# Altium project ControladorCarga.PrjPcb
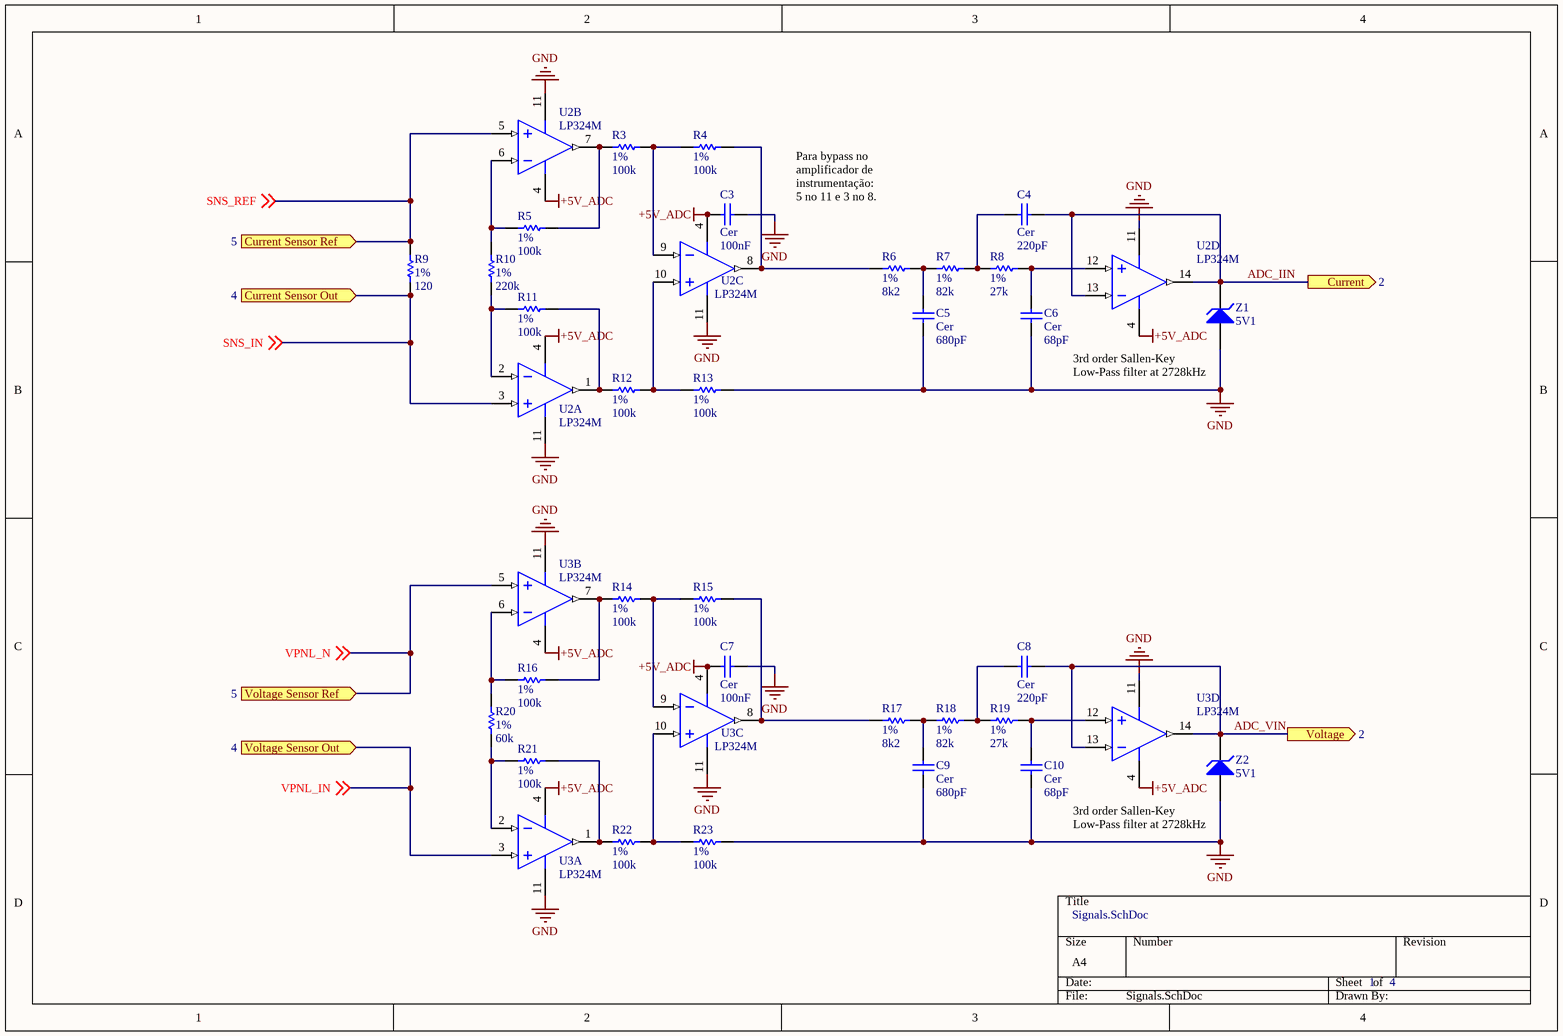
[diagram p0: Signals.SchDoc]
5 sheets, 102 parts. Net scope: flat (ports and power ports of the same name join across sheets).
Board file: PCB4.PcbDoc
Sheets:
  Signals.SchDoc
  uController.SchDoc
  voltageSupplies.SchDoc
  cuk.SchDoc
  protecao.SchDoc

## Sheet Signals.SchDoc: Signals.SchDoc
size A4; DocumentNumber: 2; SheetNumber: 1; SheetTotal: 4

### Parts
C3  Cer  value 100nF  [C1210_M]
C4  Cer  value 220pF  [6-0805_M]
C5  Cer  value 680pF  [6-0805_M]
C6  Cer  value 68pF  [6-0805_M]
C7  Cer  value 100nF  [C1210_M]
C8  Cer  value 220pF  [6-0805_M]
C9  Cer  value 680pF  [6-0805_M]
C10  Cer  value 68pF  [6-0805_M]
R3  1%  value 100k  [6-0805_M]
R4  1%  value 100k  [6-0805_M]
R5  1%  value 100k  [6-0805_M]
R6  1%  value 8k2  [6-0805_M]
R7  1%  value 82k  [6-0805_M]
R8  1%  value 27k  [6-0805_M]
R9  1%  value 120  [6-0805_M]
R10  1%  value 220k  [6-0805_M]
R11  1%  value 100k  [6-0805_M]
R12  1%  value 100k  [6-0805_M]
R13  1%  value 100k  [6-0805_M]
R14  1%  value 100k  [6-0805_M]
R15  1%  value 100k  [6-0805_M]
R16  1%  value 100k  [6-0805_M]
R17  1%  value 8k2  [6-0805_M]
R18  1%  value 82k  [6-0805_M]
R19  1%  value 27k  [6-0805_M]
R20  1%  value 60k  [6-0805_M]
R21  1%  value 100k  [6-0805_M]
R22  1%  value 100k  [6-0805_M]
R23  1%  value 100k  [6-0805_M]
U2  LP324M  [M14A_M]  (parts A,B,C,D of 4)
U3  LP324M  [M14A_M]  (parts A,B,C,D of 4)
Z1  5V1  [C1210_M]
Z2  5V1  [C1210_M]

### Ports
Current (out, see 2), Current Sensor Out (in, see 4), Current Sensor Ref (in, see 5), Voltage (out, see 2), Voltage Sensor Out (in, see 4), Voltage Sensor Ref (in, see 5)

### Nets
+5V_ADC: C3.2 C7.2 U2.4(V+) U3.4(V+)
GND: C3.1 C5.1 C6.1 C7.1 C9.1 C10.1 R13.1 R23.1 U2.11(GND) U3.11(GND) Z1.1(A) Z2.1(A)
ADC_IIN: C4.2 U2.13(IN4-) U2.14(OUT4) Z1.2(K) ; port Current
ADC_VIN: C8.2 U3.13(IN4-) U3.14(OUT4) Z2.2(K) ; port Voltage
SNS_IN: R9.1 U2.3(IN1+) ; off-sheet SNS_IN, port Current Sensor Out
SNS_REF: R9.2 U2.5(IN2+) ; off-sheet SNS_REF, port Current Sensor Ref
VPNL_IN: U3.3(IN1+) ; off-sheet VPNL_IN, port Voltage Sensor Out
VPNL_N: U3.5(IN2+) ; off-sheet VPNL_N, port Voltage Sensor Ref
NetC4_1: C4.1 R7.1 R8.2
NetC5_2: C5.2 R6.1 R7.2
NetC6_2: C6.2 R8.1 U2.12(IN4+)
NetC8_1: C8.1 R18.1 R19.2
NetC9_2: C9.2 R17.1 R18.2
NetC10_2: C10.2 R19.1 U3.12(IN4+)
NetR3_1: R3.1 R4.2 U2.9(IN3-)
NetR3_2: R3.2 R5.2 U2.7(OUT2)
NetR4_1: R4.1 R6.2 U2.8(OUT3)
NetR5_1: R5.1 R10.2 U2.6(IN2-)
NetR10_1: R10.1 R11.2 U2.2(IN1-)
NetR11_1: R11.1 R12.2 U2.1(OUT1)
NetR12_1: R12.1 R13.2 U2.10(IN3+)
NetR14_1: R14.1 R15.2 U3.9(IN3-)
NetR14_2: R14.2 R16.2 U3.7(OUT2)
NetR15_1: R15.1 R17.2 U3.8(OUT3)
NetR16_1: R16.1 R20.2 U3.6(IN2-)
NetR20_1: R20.1 R21.2 U3.2(IN1-)
NetR21_1: R21.1 R22.2 U3.1(OUT1)
NetR22_1: R22.1 R23.2 U3.10(IN3+)

### Notes on the sheet
- Para bypass no amplificador de instrumentação:
  5 no 11 e 3 no 8.
- 3rd order Sallen-Key Low-Pass filter at 2728kHz

### Library data of the parts
C3-C10 = Cap: Capacitor; Published: 8-Jun-2000; LatestRevisionDate: 17-Jul-2002; LatestRevisionNote: Re-released for DXP Platform.; PackageReference: RAD-0.3; Publisher: Altium Limited; PackageDescription: Radial Cap, Thru-Hole; 2 Leads; 0.3 in Pin Spacing
R3-R23 = Res1: Resistor; Published: 8-Jun-2000; LatestRevisionDate: 17-Jul-2002; LatestRevisionNote: Re-released for DXP Platform.; PackageReference: AXIAL-0.3; Publisher: Altium Limited; PackageDescription: Axial Device, Thru-Hole; 2 Leads; 0.3 in Pin Spacing
U2 U3 = LP324M: Micropower Quad Operational Amplifier; Manufacturer: National Semiconductor; CompType: Amplifiers; PackageTopMarking: NSUZXYTT*LP324M; PowerWise: N; Published: 4-Dec-2008; DatasheetVersion: Jul-2001; PackageVersion: revJ, Jan-1996; PackageReference: M14A; Publisher: Altium Limited; PackageDescription: Molded Package S.O., .150in Wide, 14 Lead; PartNumber: LP324M; RoHS: O; PinCount: 14; DigiKeyPartNumber: LP324MXCT-ND; Code_JEDEC: MS-012AB; Code_IPC: SOIC127P600-14; ComponentLink1Description: LP324 Datasheet; ComponentLink1URL: http://www.national.com/ds/LP/LP324.pdf; ComponentLink2Description: LP324 Web Page; ComponentLink2URL: http://www.national.com/pf/LP/LP324.html; ComponentLink3Description: M14A Package Page; ComponentLink3URL: http://www.national.com/packaging/folders/m14a.html
Z1 Z2 = D Zener: Zener Diode; Published: 8-Jun-2000; LatestRevisionDate: 17-Jul-2002; LatestRevisionNote: Re-released for DXP Platform.; PackageReference: DIODE-0.7; Publisher: Altium Limited; PackageDescription: Diode, Thru-Hole; 2 Leads; 0.7 in Pin Spacing

## Sheet uController.SchDoc: uController.SchDoc
size A4; DocumentNumber: 3; SheetNumber: 2; SheetTotal: 4; PageSetup: Record=PageOptions|CenterHorizontal=True|CenterVertical=True|PrintScale=0.73|XCorrection=1.00|YCorrection=1.00|PrintKind=1|BorderSize=5000000|LeftOffset=0|BottomOffset=0|Orientation=2|PaperLength=1000|PaperWidth=1000|Scale=100|PaperSource=257|PrintQuality=1200|MediaType=1|DitherType=10|PaperKind=A4|PrintScaleMode=1
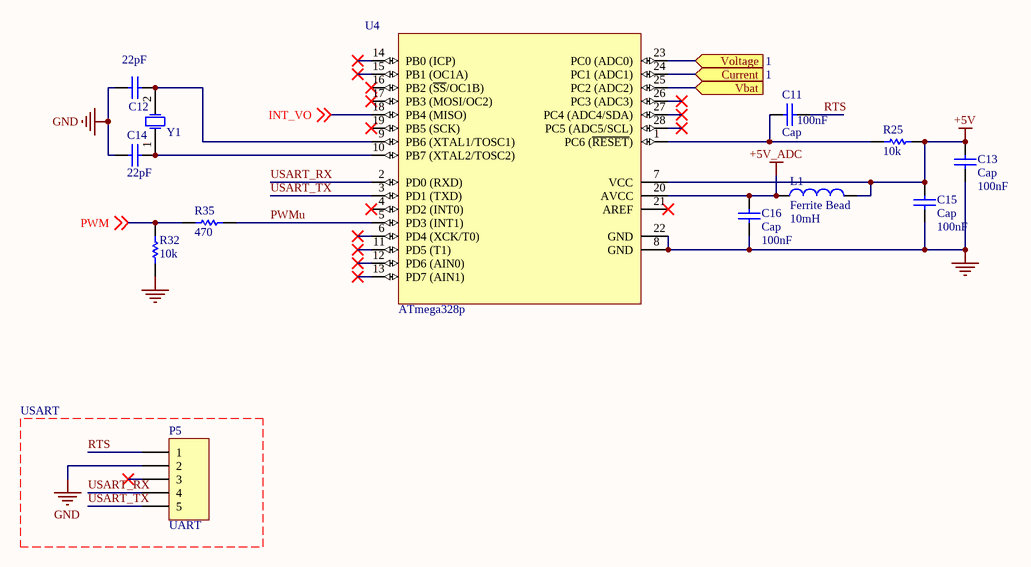
[diagram p1: uController.SchDoc]

### Parts
C11  Cap  value 100nF  [6-0805_M]
C12  22pF  [C0805]
C13  Cap  value 100nF  [C1210_M]
C14  22pF  [C0805]
C15  Cap  value 100nF  [6-0805_M]
C16  Cap  value 100nF  [6-0805_M]
L1  Ferrite Bead  value 10mH  [6-0805_M]
P5  UART  [HDR1X5]
R25  value 10k  [6-0805_M]  (hidden comment: Res1)
R32  value 10k  [6-0805_M]  (hidden comment: Res1)
R35  470  [6-0805_M]
U4  ATmega328p  [28P3]
Y1  (no value)  [HC-49U]

### Ports
Current (in, see 1), Vbat (in), Voltage (in, see 1)

### Nets
+5V: C13.1 C15.1 L1.2 R25.2 U4.7(VCC)
+5V_ADC: C16.1 L1.1 U4.20(AVCC)
GND: C12.1 C13.2 C14.1 C15.2 C16.2 P5.2 R32.1 U4.8(GND) U4.22(GND)
ADC_IIN: U4.24(PC1_(ADC1)) ; port Current
ADC_Vbat: U4.25(PC2_(ADC2)) ; port Vbat
ADC_VIN: U4.23(PC0_(ADC0)) ; port Voltage
INT_VO: U4.18(PB4_(MISO)) ; off-sheet INT_VO
PWM: R32.2 R35.1 ; off-sheet PWM
PWMu: R35.2 U4.5(PD3_(INT1))
RTS: C11.2 P5.1
USART_RX: P5.4 U4.2(PD0_(RXD))
USART_TX: P5.5 U4.3(PD1_(TXD))
NetC11_1: C11.1 R25.1 U4.1(PC6_(~{RESET}))
NetC12_2: C12.2 U4.9(PB6_(XTAL1/TOSC1)) Y1.2(OSC2)
NetC14_2: C14.2 U4.10(PB7_(XTAL2/TOSC2)) Y1.1(OSC1)

Not connected (* = marked no-connect by the designer): P5 3*; U4 4(PD2_(INT0))* 6(PD4_(XCK/T0))* 11(PD5_(T1))* 12(PD6_(AIN0))* 13(PD7_(AIN1))* 14(PB0_(ICP))* 15(PB1_(OC1A))* 16(PB2_(~{SS}/OC1B))* 17(PB3_(MOSI/OC2))* 19(PB5_(SCK))* 21(AREF)* 26(PC3_(ADC3))* 27(PC4_(ADC4/SDA))* 28(PC5_(ADC5/SCL))*

### Notes on the sheet
- USART

### Library data of the parts
C11 C13 C15 C16 = Cap: Capacitor; Published: 8-Jun-2000; LatestRevisionDate: 17-Jul-2002; LatestRevisionNote: Re-released for DXP Platform.; PackageReference: RAD-0.3; Publisher: Altium Limited; PackageDescription: Radial Cap, Thru-Hole; 2 Leads; 0.3 in Pin Spacing
C12 C14 = Cap Semi: Capacitor (Semiconductor SIM Model); Published: 8-Jun-2000; LatestRevisionDate: 29-May-2009; LatestRevisionNote: IPC-7351 Footprint Added.; PackageReference: C1206; Publisher: Altium Limited; PackageDescription: Chip Capacitor; Value: 22pF
L1 = Inductor: Code_IEC: 1005; Published: 8-Jun-2000; LatestRevisionDate: 29-May-2009; LatestRevisionNote: IPC-7351 Footprint Added.; PackageReference: 0402-A; Publisher: Altium Limited; PackageDescription: Chip Inductor; Code_JEITA: 0402
P5 = Header 5: Header, 5-Pin; LatestRevisionDate: 17-Jul-2002; LatestRevisionNote: Re-released for DXP Platform.; Publisher: Altium Limited
R25 R32 R35 = Res1: Resistor; Published: 8-Jun-2000; LatestRevisionDate: 17-Jul-2002; LatestRevisionNote: Re-released for DXP Platform.; PackageReference: AXIAL-0.3; Publisher: Altium Limited; PackageDescription: Axial Device, Thru-Hole; 2 Leads; 0.3 in Pin Spacing
  R35: Value: 470
U4 = ATmega8-16PI: 8-Bit AVR Microcontroller with 8K Bytes of In-System Programmable Flash Memory; Published: 17-Sep-2003; LatestRevisionDate: 04-Mar-2005; LatestRevisionNote: Stylized 3D Model Added.; DatasheetVersion: 2486H-AVR-09/02; PackageVersion: revB, Sep-2001; PackageReference: 28P3; Publisher: Altium Limited; PackageDescription: DIP; 28 Leads; Row Spacing 7.62 mm; Pitch 2.54 mm; ComponentLink1Description: Manufacturer Link; ComponentLink1URL: http://www.atmel.com; ComponentLink2Description: Datasheet; ComponentLink2URL: http://www.atmel.com/dyn/resources/prod_documents/doc2486.pdf
Y1 = Crystal: Crystal Oscillator

## Sheet voltageSupplies.SchDoc: voltageSupplies.SchDoc
size A; DocumentNumber: 4; SheetNumber: 3; SheetTotal: 4
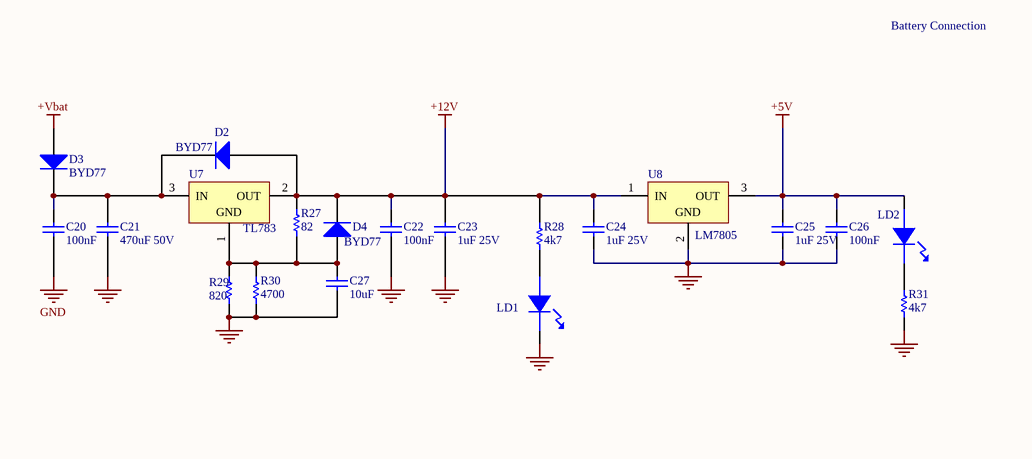
[diagram p2: voltageSupplies.SchDoc]

### Parts
C20  value 100nF  [C1210_M]  (hidden comment: Cap)
C21  value 470uF 50V  [CapEltr-Rad4.1-Dpp3.0]  (hidden comment: Cap)
C22  value 100nF  [C1210_M]  (hidden comment: Cap)
C23  value 1uF 25V  [CapEltr-Rad4.1-Dpp3.0]  (hidden comment: Cap)
C24  value 1uF 25V  [CapEltr-Rad4.1-Dpp3.0]  (hidden comment: Cap)
C25  value 1uF 25V  [CapEltr-Rad4.1-Dpp3.0]  (hidden comment: Cap)
C26  value 100nF  [C1210_M]  (hidden comment: Cap)
C27  value 10uF  [C1210_M]  (hidden comment: Cap)
D2  BYD77  [SOD87]
D3  value BYD77  [SOD87]  (hidden comment: Diode 1N4002)
D4  value BYD77  [SOD87]  (hidden comment: 1N4002)
LD1  RED  [6-0805_M]  (value not drawn)
LD2  RED  [6-0805_M]  (value not drawn)
R27  value 82  [6-0805_M]  (hidden comment: Res1)
R28  value 4k7  [6-0805_M]  (hidden comment: Res1)
R29  value 820  [6-0805_M]  (hidden comment: Res1)
R30  value 4700  [6-0805_M]  (hidden comment: Res1)
R31  value 4k7  [6-0805_M]  (hidden comment: Res1)
U7  TL783  [TO-220AB]
U8  LM7805  [TO-220AB]

### Nets
+5V: C25.2 C26.2 LD2.1 U8.3(OUT)
+12V: C22.2 C23.2 C24.2 D2.1(A) D4.2(K) R27.1 R28.2 U7.2(OUT) U8.1(IN)
+Vbat: D3.1(A)
GND: C20.1 C21.1 C22.1 C23.1 C24.1 C25.1 C26.1 C27.1 LD1.2 R29.1 R30.1 R31.1 U8.2(GND)
NetC20_2: C20.2 C21.2 D2.2(K) D3.2(K) U7.3(IN)
NetC27_2: C27.2 D4.1(A) R27.2 R29.2 R30.2 U7.1(ADJ)
NetLD1_1: LD1.1 R28.1
NetLD2_2: LD2.2 R31.2

### Notes on the sheet
- Battery Connection
- Pinagem compativel com LM317, modificando os resistores para:
  R3=240, R7=2k2, R6=33k
  tl783 -> (R102 // R103) = ((Vo/Vref) – 1) / R100
- (in symbol L7805ACV) GND

### Library data of the parts
C20-C27 = Cap: Capacitor; Published: 8-Jun-2000; LatestRevisionDate: 17-Jul-2002; LatestRevisionNote: Re-released for DXP Platform.; PackageReference: RAD-0.3; Publisher: Altium Limited; PackageDescription: Radial Cap, Thru-Hole; 2 Leads; 0.3 in Pin Spacing
D2-D4 = Diode 1N4002: 1 Amp General Purpose Rectifier; pin to pad: 1>A 2>K; Published: 8-Jun-2000; LatestRevisionDate: 17-Jul-2002; LatestRevisionNote: Re-released for DXP Platform.; DatasheetVersion: 1998; PackageVersion: Aug-1999; PackageReference: DO-41; Publisher: Altium Limited; PackageDescription: Diode, Axial; Body 5.2 x 2.7 mm (LxDia. max), Lead Dia. 0.86 mm (max); Code_JEDEC: DO-204-AL; ComponentLink1Description: Manufacturer Link; ComponentLink1URL: http://www.fairchildsemi.com/; ComponentLink2Description: Datasheet; ComponentLink2URL: http://www.fairchildsemi.com/ds/1N%2F1N4001.pdf
  D2: value: BYD77
LD1 LD2 = LED: Diodo Emissor de Luz; value: Led 0805 Vermelho
R27-R31 = Res1: Resistor; Published: 8-Jun-2000; LatestRevisionDate: 17-Jul-2002; LatestRevisionNote: Re-released for DXP Platform.; PackageReference: AXIAL-0.3; Publisher: Altium Limited; PackageDescription: Axial Device, Thru-Hole; 2 Leads; 0.3 in Pin Spacing
U7 = L7805ACV: Precision 1A Regulator; Note: Tab is connected to pin 3 (GND).; value: LT783; Published: 24-Aug-2001; LatestRevisionDate: 17-Jul-2002; LatestRevisionNote: Re-released for DXP Platform.; DatasheetVersion: Nov-1999; PackageVersion: Jun-1998; PackageReference: TO220ABN; Publisher: Altium Limited; PackageDescription: TO, Thru-Hole, Vertical, Heatsink Mounted; 3 In-Line Leads; Pitch 2.54 mm; Pin sequence 1, 3, 2; ComponentLink1Description: Manufacturer Link; ComponentLink1URL: http://www.st.com/; ComponentLink2Description: Datasheet; ComponentLink2URL: http://www.st.com/stonline/products/literature/ds/2144/l7805ab.pdf
U8 = µA7805CKC: Positive-Voltage Regulator; Note: Pin 2 is electrically connected to TAB.; Published: 15-Apr-2002; DatasheetVersion: Jul-1999; PackageVersion: Sep-1995; PackageReference: KC03; Publisher: Altium Limited; PackageDescription: TO, Thru-Hole, Vertical, Heatsink Mounted; 3 In-Line Leads; Pitch 2.54 mm; ComponentLink1Description: Manufacturer Link; ComponentLink1URL: http://www.ti.com/; ComponentLink2Description: Datasheet; ComponentLink2URL: http://www-s.ti.com/sc/ds/ua7805.pdf

## Sheet cuk.SchDoc: cuh.SchDoc
size A4; DocumentNumber: 5; SheetNumber: 4; SheetTotal: 4
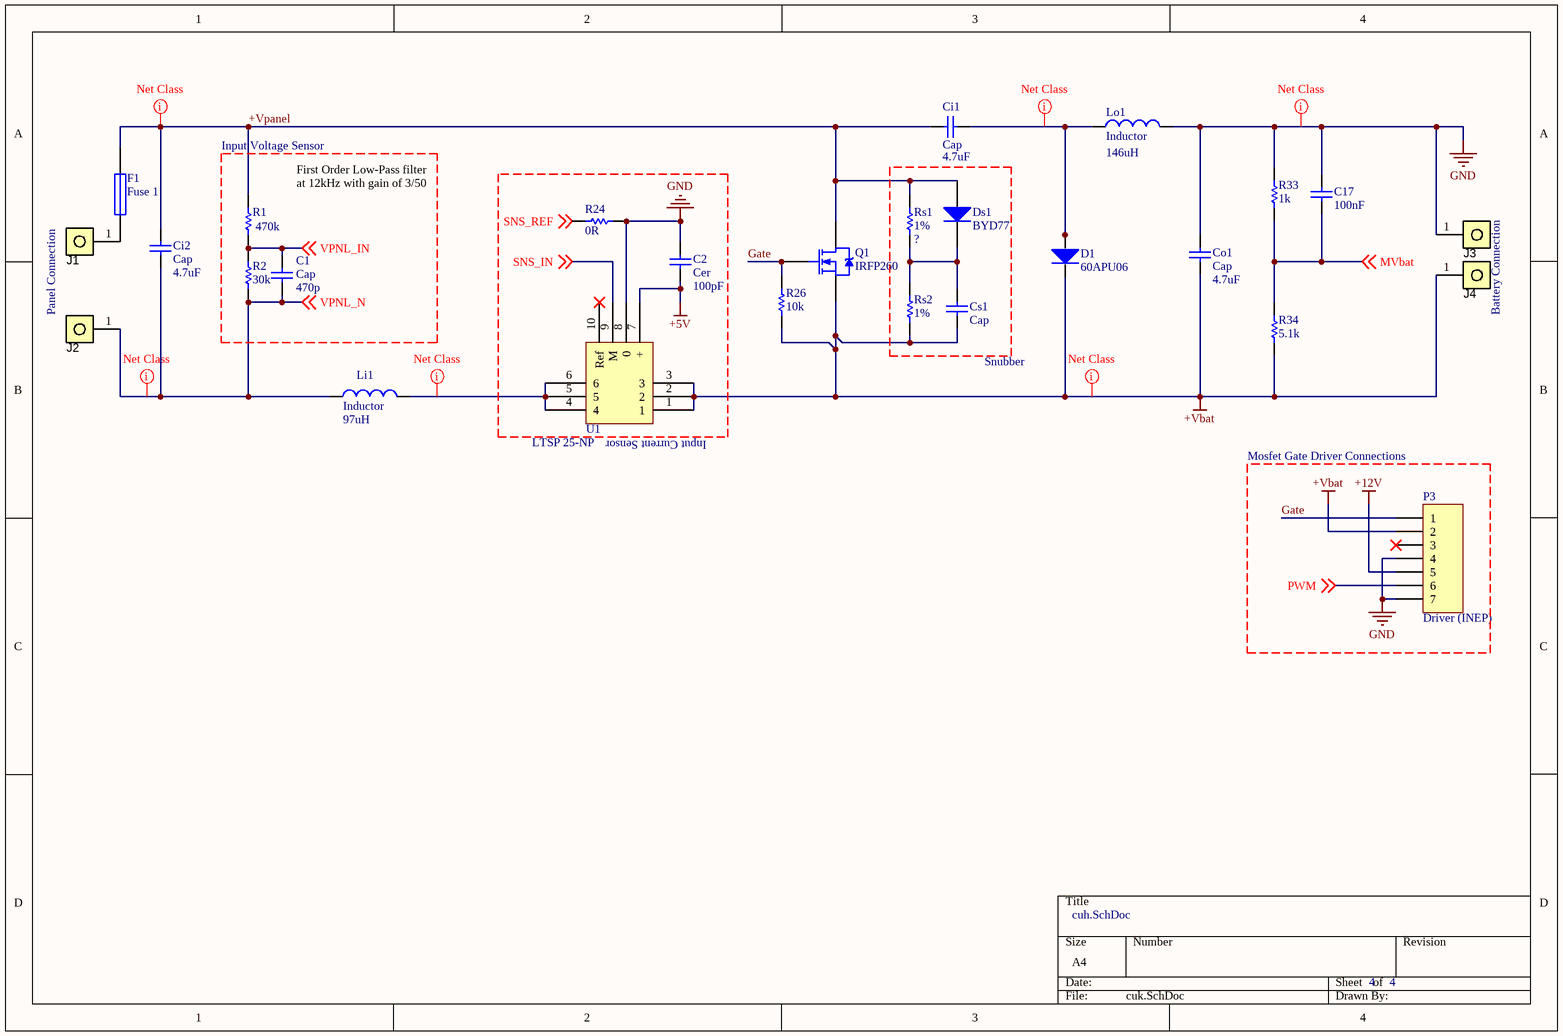
[diagram p3: cuk.SchDoc]

### Parts
C1  Cap  value 470p  [6-0805_N]
C2  Cer  value 100pF  [C1210_M]
C17  100nF  [6-0805_M]
Ci1  Cap  value 4.7uF  [CAP4U7 EPCOS]
Ci2  Cap  value 4.7uF  [CAP4U7 EPCOS]
Co1  Cap  value 4.7uF  [CAP4U7 EPCOS]
Cs1  Cap  [100nF]
D1  60APU06  [to-247ac_horizontal]
Ds1  BYD77  [SOD87]
F1  Fuse 1  [FUSE HOLDER 5X20]
J1  (no value)  [Parafuso]
J2  (no value)  [Parafuso]
J3  (no value)  [Parafuso]
J4  (no value)  [Parafuso]
Li1  Inductor  value 97uH  [NEE-42-20-deitado]
Lo1  Inductor  value 146uH  [NEE-42-20-deitado]
P3  Driver (INEP)  [Driver INEP]
Q1  IRFP260  [to-247ac_horizontal]
R1  value 470k  [6-0805_N]  (hidden comment: Res1)
R2  value 30k  [6-0805_N]  (hidden comment: Res1)
R24  value 0R  [6-0805_N]  (hidden comment: Res1)
R26  value 10k  [6-0805_N]  (hidden comment: Res1)
R33  1k  [6-0805_M]
R34  5.1k  [6-0805_M]
Rs1  1%  [AXIAL-0.3]
Rs2  1%  [AXIAL-0.3]
U1  LTSP 25-NP  [LTSP 25-NP]

### Nets
+5V: C2.1 U1.7(+)
+12V: P3.5
+Vbat: Co1.1 Cs1.1 D1.2(K) J4.1 P3.2 Q1.3(S) R26.2 R34.1 Rs2.2 U1.1 U1.2 U1.3
GND: C2.2 C17.2 Co1.2 J3.1 Lo1.2 P3.4 P3.7 R24.2 R33.2 U1.8(0)
+Vpanel: Ci1.1 Ci2.2 Ds1.1(A) F1.2 Q1.2(D) R1.1 Rs1.2
Gate: P3.1 Q1.1(G) R26.1
MVbat: C17.1 R33.1 R34.2 ; off-sheet MVbat
PWM: P3.6 ; off-sheet PWM
SNS_IN: U1.9(M) ; off-sheet SNS_IN
SNS_REF: R24.1 ; off-sheet SNS_REF
VPNL_IN: C1.1 R1.2 R2.1 ; off-sheet VPNL_IN
VPNL_N: C1.2 Ci2.1 J2.1 Li1.1 R2.2 ; off-sheet VPNL_N
NetCi1_2: Ci1.2 D1.1(A) D1.3(A) Lo1.1
NetCs1_2: Cs1.2 Ds1.2(K) Rs1.1 Rs2.1
NetF1_1: F1.1 J1.1
NetLi1_2: Li1.2 U1.4 U1.5 U1.6

Not connected (* = marked no-connect by the designer): P3 3*; U1 10(Ref)*

### Layout directives
net class PanelBetweenBatteryConnection: +Vbat, +Vpanel, GND, NetCi1_2, NetLi1_2, VPNL_N

### Notes on the sheet
- Input Voltage Sensor
- First Order Low-Pass filter at 12kHz with gain of 3/50
- Panel Connection
- Battery Connection
- (near Cs1) Snubber
- (near U1) Input Current Sensor
- Mosfet Gate Driver Connections

### Library data of the parts
C1 C2 Ci1 Ci2 Co1 Cs1 = Cap: Capacitor; Published: 8-Jun-2000; LatestRevisionDate: 17-Jul-2002; LatestRevisionNote: Re-released for DXP Platform.; PackageReference: RAD-0.3; Publisher: Altium Limited; PackageDescription: Radial Cap, Thru-Hole; 2 Leads; 0.3 in Pin Spacing
  Cs1: Value: ?
C17 = Cap_3: Capacitor; Published: 8-Jun-2000; LatestRevisionDate: 17-Jul-2002; LatestRevisionNote: Re-released for DXP Platform.; PackageReference: RAD-0.3; Publisher: Altium Limited; PackageDescription: Radial Cap, Thru-Hole; 2 Leads; 0.3 in Pin Spacing; Value: 100nF
Ds1 = Diode 1N4002: 1 Amp General Purpose Rectifier; pin to pad: 1>A 2>K; Published: 8-Jun-2000; LatestRevisionDate: 17-Jul-2002; LatestRevisionNote: Re-released for DXP Platform.; DatasheetVersion: 1998; PackageVersion: Aug-1999; PackageReference: DO-41; Publisher: Altium Limited; PackageDescription: Diode, Axial; Body 5.2 x 2.7 mm (LxDia. max), Lead Dia. 0.86 mm (max); Code_JEDEC: DO-204-AL; ComponentLink1Description: Manufacturer Link; ComponentLink1URL: http://www.fairchildsemi.com/; ComponentLink2Description: Datasheet; ComponentLink2URL: http://www.fairchildsemi.com/ds/1N%2F1N4001.pdf; value: BYD77
F1 = Fuse 1: Fuse; Published: 8-Jun-2000; LatestRevisionDate: 17-Jul-2002; LatestRevisionNote: Re-released for DXP Platform.; PackageReference: PIN-W2/E2.8; Publisher: Altium Limited; PackageDescription: Thru-Hole; 2 Leads
J1-J4 = PIN_BIG: Description 1: Header 1x1; Código: PIN_BIG; Footprint: CON_1_big; PackageReference: CON_1_big
Li1 = Inductor: Code_IEC: 1005; Published: 8-Jun-2000; LatestRevisionDate: 29-May-2009; LatestRevisionNote: IPC-7351 Footprint Added.; PackageReference: 0402-A; Publisher: Altium Limited; PackageDescription: Chip Inductor; Code_JEITA: 0402
Lo1 = Inductor: pin to pad: 1>2 2>1; Code_IEC: 1005; Published: 8-Jun-2000; LatestRevisionDate: 29-May-2009; LatestRevisionNote: IPC-7351 Footprint Added.; PackageReference: 0402-A; Publisher: Altium Limited; PackageDescription: Chip Inductor; Code_JEITA: 0402
P3 = Header 7: Header, 7-Pin; LatestRevisionDate: 17-Jul-2002; LatestRevisionNote: Re-released for DXP Platform.; Publisher: Altium Limited
Q1 = IRFP260: HEXFET Power MOSFET; Note: Pin 2 is electrically connected to the Heatsink (4).; Published: 8-Jun-2000; LatestRevisionDate: 17-Jul-2002; LatestRevisionNote: Re-released for DXP Platform.; DatasheetVersion: PD-9.755; PackageVersion: Aug-1997; PackageReference: TO-247AC; Publisher: Altium Limited; PackageDescription: SIP with Mounting Hole; 3 Leads; Body 20 x 15.6 x 5 mm (typ); Pitch 5.45 mm; Code_JEDEC: TO-247-AC; ComponentLink1Description: Manufacturer Link; ComponentLink1URL: http://www.irf.com/; ComponentLink2Description: Datasheet; ComponentLink2URL: http://www.irf.com/product-info/datasheets/data/irfp260.pdf
R1 R2 R24 R26 R33 R34 Rs1 Rs2 = Res1: Resistor; Published: 8-Jun-2000; LatestRevisionDate: 17-Jul-2002; LatestRevisionNote: Re-released for DXP Platform.; PackageReference: AXIAL-0.3; Publisher: Altium Limited; PackageDescription: Axial Device, Thru-Hole; 2 Leads; 0.3 in Pin Spacing
  R33: Value: 1k
  R34: Value: 5.1k
  Rs1 Rs2: Value: ?
U1 = LTSP 25-NP: Current Transducer LTSP (25 A)

## Sheet protecao.SchDoc
size A4
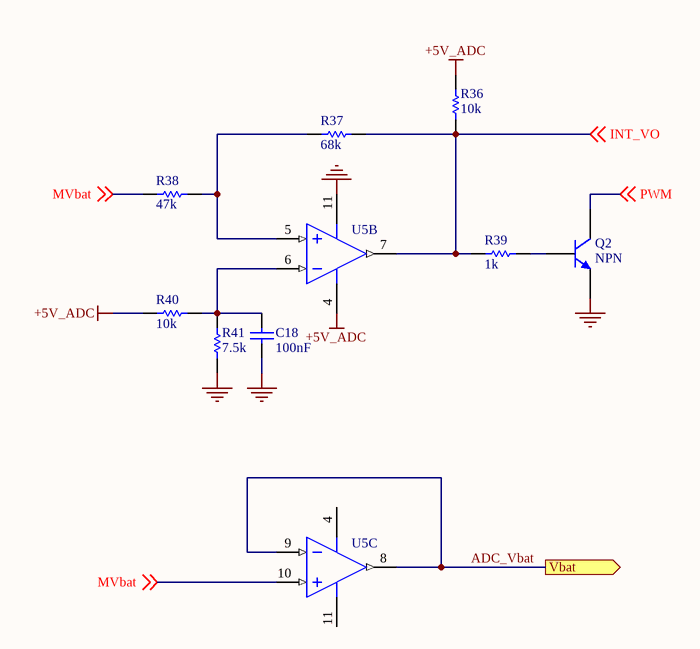
[diagram p4: protecao.SchDoc]

### Parts
C18  100nF  [6-0805_M]
Q2  NPN  [TO-226-AA]
R36  10k  [6-0805_M]
R37  68k  [6-0805_M]
R38  47k  [6-0805_M]
R39  1k  [6-0805_M]
R40  10k  [6-0805_M]
R41  7.5k  [6-0805_M]
U5  LP324M  [M14A_M]  (value not drawn)  (parts B,C of 4)

### Ports
Vbat (out)

### Nets
+5V_ADC: R36.1 R40.1 U5.4(V+)
GND: C18.1 Q2.3(E) R41.1 U5.11(GND)
ADC_Vbat: U5.8(OUT3) U5.9(IN3-) ; port Vbat
INT_VO: R36.2 R37.2 R39.1 U5.7(OUT2) ; off-sheet INT_VO
MVbat: R38.1 U5.10(IN3+) ; off-sheet MVbat
PWM: Q2.1(C) ; off-sheet PWM
NetC18_2: C18.2 R40.2 R41.2 U5.6(IN2-)
NetQ2_2: Q2.2(B) R39.2
NetR37_1: R37.1 R38.2 U5.5(IN2+)

### Library data of the parts
C18 = Cap_3: Capacitor; Published: 8-Jun-2000; LatestRevisionDate: 17-Jul-2002; LatestRevisionNote: Re-released for DXP Platform.; PackageReference: RAD-0.3; Publisher: Altium Limited; PackageDescription: Radial Cap, Thru-Hole; 2 Leads; 0.3 in Pin Spacing; Value: 100nF
Q2 = NPN: NPN Bipolar Transistor; Published: 8-Jun-2000; LatestRevisionDate: 17-Jul-2002; LatestRevisionNote: Re-released for DXP Platform.; PackageReference: TO-226-AA; Publisher: Altium Limited; PackageDescription: TO, Flat Index; 3 In-Line, Axial Leads; Body Dia. 4.8mm; Leads 0.55 x 0.51 mm (max); Code_JEDEC: TO-226-AA
R36-R41 = Res1: Resistor; Published: 8-Jun-2000; LatestRevisionDate: 17-Jul-2002; LatestRevisionNote: Re-released for DXP Platform.; PackageReference: AXIAL-0.3; Publisher: Altium Limited; PackageDescription: Axial Device, Thru-Hole; 2 Leads; 0.3 in Pin Spacing
  R36 R40: Value: 10k
  R37: Value: 68k
  R38: Value: 47k
  R39: Value: 1k
  R41: Value: 7.5k
U5 = LP324M: as U2 on sheet Signals; Published: 4-Dec-2008; DatasheetVersion: Jul-2001; PackageVersion: revJ, Jan-1996; PackageReference: M14A; Publisher: Altium Limited; PackageDescription: Molded Package S.O., .150in Wide, 14 Lead; PartNumber: LP324M; RoHS: O; PinCount: 14; DigiKeyPartNumber: LP324MXCT-ND; Code_JEDEC: MS-012AB; Code_IPC: SOIC127P600-14; ComponentLink1Description: LP324 Datasheet; ComponentLink1URL: http://www.national.com/ds/LP/LP324.pdf; ComponentLink2Description: LP324 Web Page; ComponentLink2URL: http://www.national.com/pf/LP/LP324.html; ComponentLink3Description: M14A Package Page; ComponentLink3URL: http://www.national.com/packaging/folders/m14a.html

## Nets that join several sheets
+5V: uController (5 pins), voltageSupplies (C25.2 C26.2 LD2.1 U8.3), cuk (C2.1 U1.7)
+5V_ADC: Signals (C3.2 C7.2 U2.4 U3.4), uController (C16.1 L1.1 U4.20), protecao (R36.1 R40.1 U5.4)
+12V: voltageSupplies (9 pins), cuk (P3.5)
+Vbat: voltageSupplies (D3.1), cuk (12 pins)
GND: Signals (12 pins), uController (9 pins), voltageSupplies (13 pins), cuk (10 pins), protecao (C18.1 Q2.3 R41.1 U5.11)
ADC_IIN: Signals (C4.2 U2.13 U2.14 Z1.2), uController (U4.24)
ADC_Vbat: uController (U4.25), protecao (U5.8 U5.9)
ADC_VIN: Signals (C8.2 U3.13 U3.14 Z2.2), uController (U4.23)
INT_VO: uController (U4.18), protecao (R36.2 R37.2 R39.1 U5.7)
MVbat: cuk (C17.1 R33.1 R34.2), protecao (R38.1 U5.10)
PWM: uController (R32.2 R35.1), cuk (P3.6), protecao (Q2.1)
SNS_IN: Signals (R9.1 U2.3), cuk (U1.9)
SNS_REF: Signals (R9.2 U2.5), cuk (R24.1)
VPNL_IN: Signals (U3.3), cuk (C1.1 R1.2 R2.1)
VPNL_N: Signals (U3.5), cuk (5 pins)